# Altium schematic sheet ICAN-7006-MIC.SchDoc
size A4; PageSetup: Record=PageOptions|CenterHorizontal=True|CenterVertical=True|PrintScale=1.42|XCorrection=1.00|YCorrection=1.00|PrintKind=0|BorderSize=5000000|LeftOffset=0|BottomOffset=0|Orientation=2|PaperLength=1000|PaperWidth=1000|Scale=100|PaperSource=7|PrintQuality=-4|MediaType=1|DitherType=10|PaperKind=A3|PrintScaleMode=1
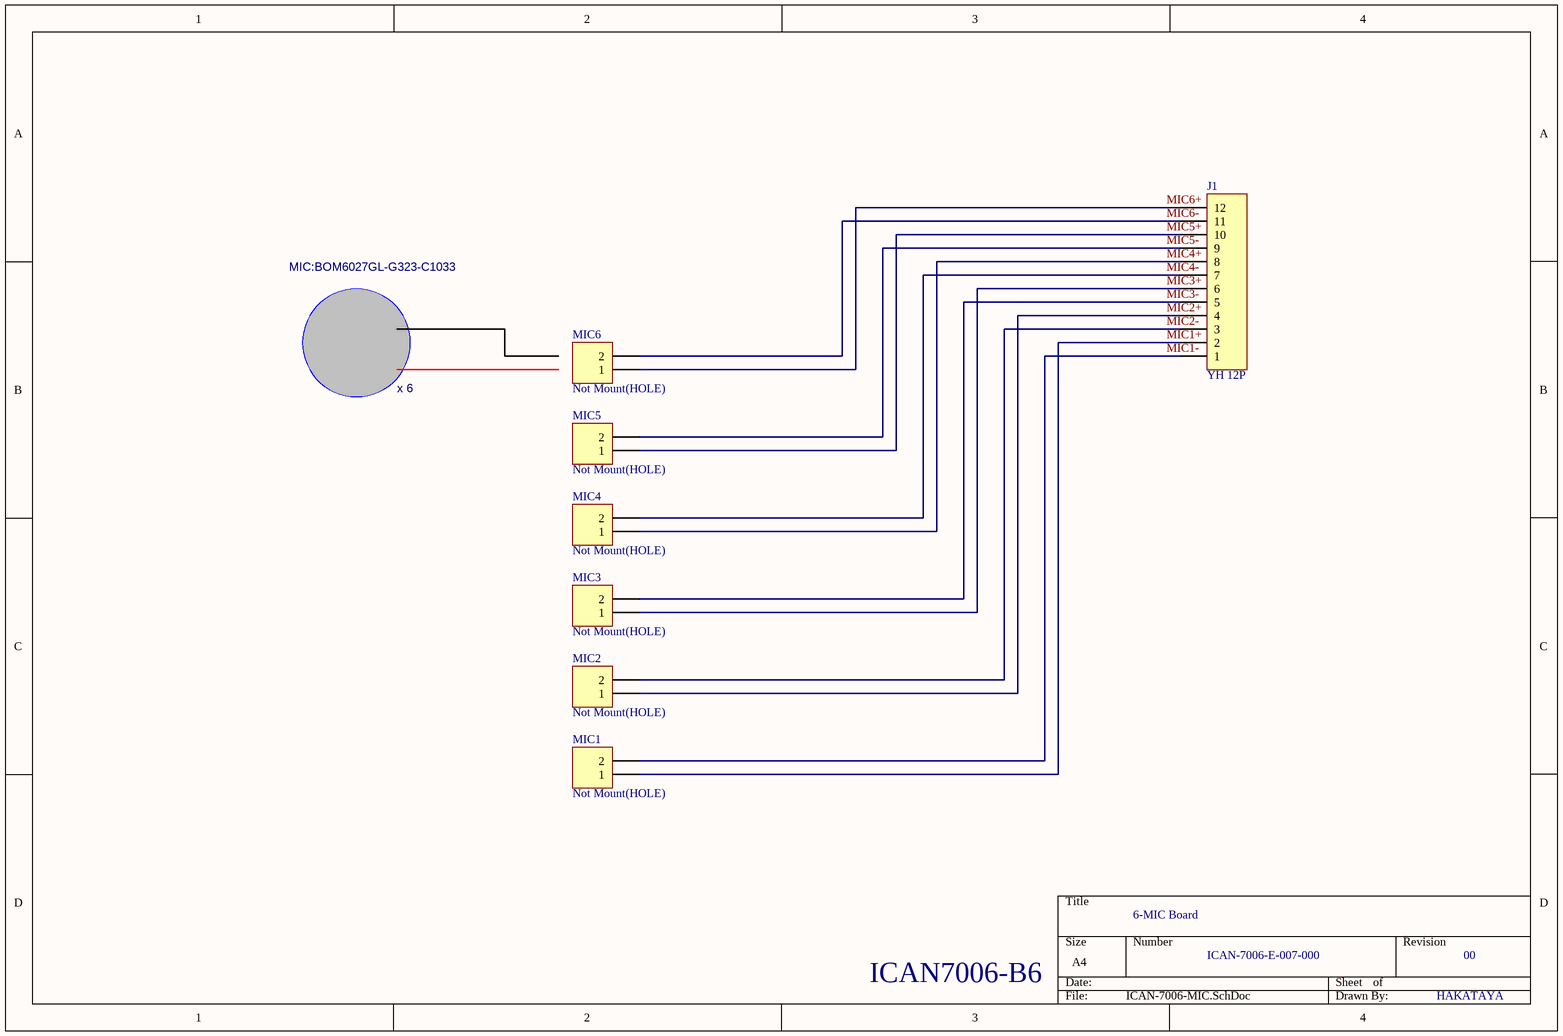
[diagram p0: ICAN-7006-MIC.SchDoc]

## Parts
J1  YH 12P  [HDR2X6]
MIC1  Not Mount(HOLE)  [MHDR1X2]
MIC2  Not Mount(HOLE)  [MHDR1X2]
MIC3  Not Mount(HOLE)  [MHDR1X2]
MIC4  Not Mount(HOLE)  [MHDR1X2]
MIC5  Not Mount(HOLE)  [MHDR1X2]
MIC6  Not Mount(HOLE)  [MHDR1X2]

## Nets
MIC1+: J1.2 MIC1.1
MIC1-: J1.1 MIC1.2
MIC2+: J1.4 MIC2.1
MIC2-: J1.3 MIC2.2
MIC3+: J1.6 MIC3.1
MIC3-: J1.5 MIC3.2
MIC4+: J1.8 MIC4.1
MIC4-: J1.7 MIC4.2
MIC5+: J1.10 MIC5.1
MIC5-: J1.9 MIC5.2
MIC6+: J1.12 MIC6.1
MIC6-: J1.11 MIC6.2

## Notes on the sheet
- MIC:BOM6027GL-G323-C1033
- x 6
- 6-MIC Board
- ICAN7006-B6
- ICAN-7006-E-007-000
- 00
- HAKATAYA

## Library data of the parts
J1 = Header 12: Header, 12-Pin; Value: A2006-12A; LatestRevisionDate: 17-Jul-2002; LatestRevisionNote: Re-released for DXP Platform.; Publisher: Altium Limited; Supplier Part Number: A2006-12A; Supplier: YOLINK
MIC1-MIC6 = Header 2: Header, 2-Pin; LatestRevisionDate: 17-Jul-2002; LatestRevisionNote: Re-released for DXP Platform.; Publisher: Altium Limited